# Altium schematic sheet Main.SchDoc
size A; SheetNumber: 1; SheetTotal: 3
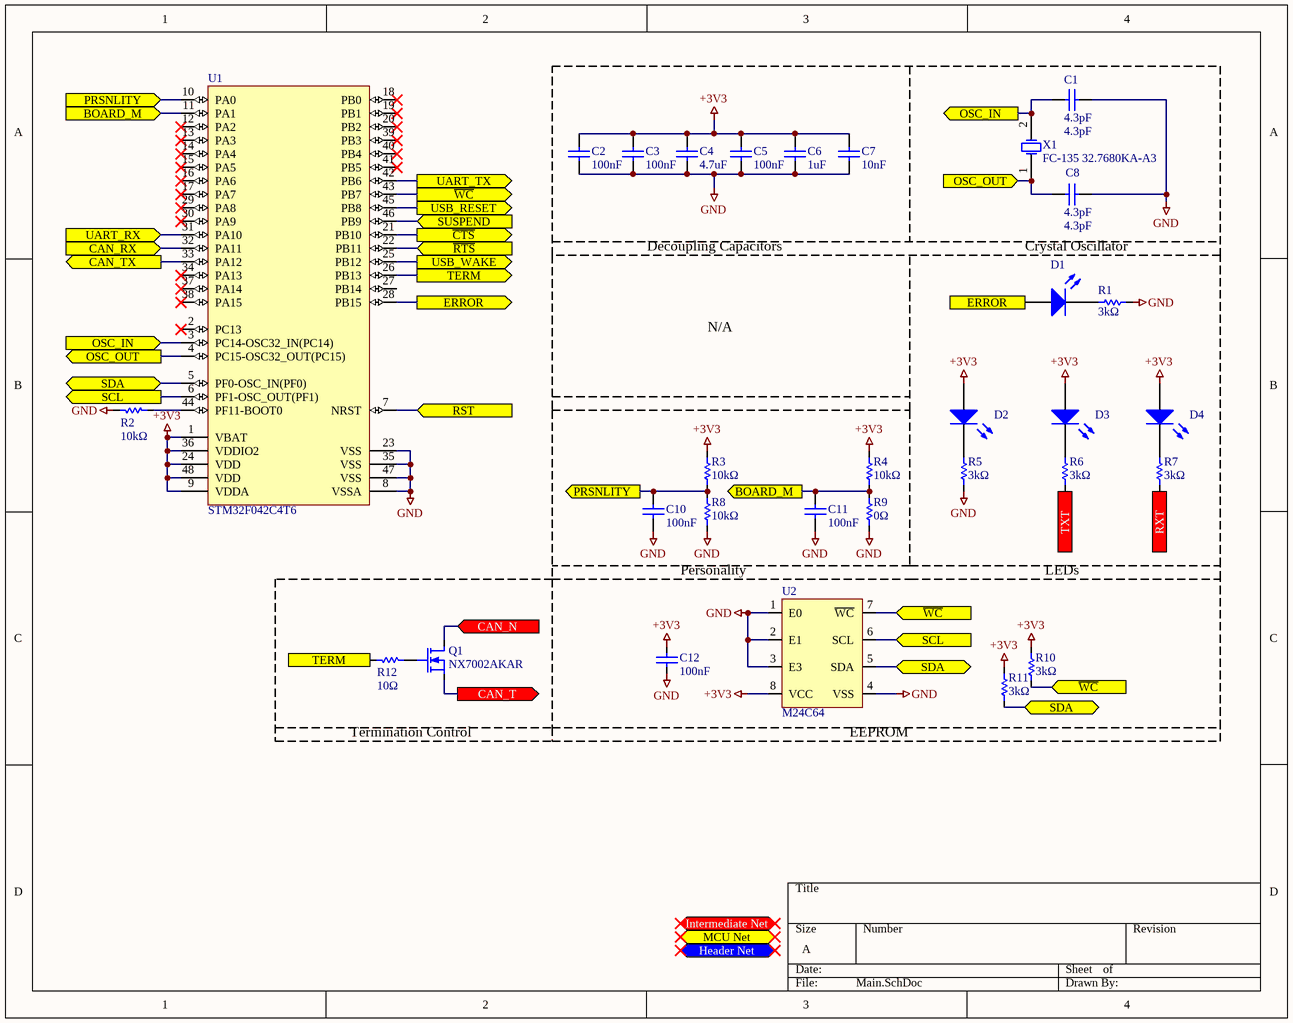
[diagram p0: Main.SchDoc]

## Parts
C1  4.3pF  [1608[0603]]
C2  100nF  [1608[0603]]
C3  100nF  [1608[0603]]
C4  4.7uF  [1608[0603]]
C5  100nF  [1608[0603]]
C6  1uF  [1608[0603]]
C7  10nF  [1608[0603]]
C8  4.3pF  [1608[0603]]
C10  100nF  [1608[0603]]
C11  100nF  [1608[0603]]
C12  100nF  [1608[0603]]
D1  POWER_ON  [1608[0603]]  (value not drawn)
D2  POWER_ON  [1608[0603]]  (value not drawn)
D3  POWER_ON  [1608[0603]]  (value not drawn)
D4  POWER_ON  [1608[0603]]  (value not drawn)
Q1  NX7002AKAR  [SOT23-6_L]
R1  value 3kΩ  [1608[0603]]  (hidden comment: 4.7k)
R2  value 10kΩ  [1608[0603]]  (hidden comment: 10k)
R3  value 10kΩ  [1608[0603]]  (hidden comment: 10k)
R4  value 10kΩ  [1608[0603]]  (hidden comment: 10k)
R5  value 3kΩ  [1608[0603]]  (hidden comment: 4.7k)
R6  value 3kΩ  [1608[0603]]  (hidden comment: 4.7k)
R7  value 3kΩ  [1608[0603]]  (hidden comment: 4.7k)
R8  value 10kΩ  [1608[0603]]  (hidden comment: 10k)
R9  value 0Ω  [1608[0603]]  (hidden comment: 0 ohm)
R10  value 3kΩ  [1608[0603]]  (hidden comment: 3k)
R11  value 3kΩ  [1608[0603]]  (hidden comment: 3k)
R12  value 10Ω  [1608[0603]]  (hidden comment: 10k)
U1  STM32F042C4T6  [STM-LQFP48_M]
U2  M24C64  [SO8_M]
X1  FC-135 32.7680KA-A3  [ESPO-FC-135-2_V]

## Ports
BOARD_M (in), BOARD_M (out), CAN_N (in), CAN_RX (in), CAN_T (out), CAN_TX (out), ERROR (in), ERROR (out), Header Net (bidir), Intermediate Net (bidir), MCU Net (bidir), OSC_IN (in), OSC_IN (out), OSC_OUT (in), OSC_OUT (out), PRSNLITY (in), PRSNLITY (out), RST (in), RXT (out), SCL (in), SCL (out), SDA (bidir), SUSPEND (in), TERM (in), TERM (out), TXT (out), UART_RX (in), UART_TX (out), USB_RESET (out), USB_WAKE (out), ~{CTS} (out), ~{RTS} (in), ~{WC} (in), ~{WC} (out)

## Nets
+3V3: C2.1 C3.1 C4.1 C5.1 C6.1 C7.1 C12.1 D2.1(A) D3.1(A) D4.1(A) R3.2 R4.2 R10.1 R11.1 U1.1(VBAT) U1.9(VDDA) U1.24(VDD) U1.36(VDDIO2) U1.48(VDD) U2.8(VCC)
GND: C1.2 C2.2 C3.2 C4.2 C5.2 C6.2 C7.2 C8.2 C10.2 C11.2 C12.2 R1.2 R2.2 R5.2 R8.1 R9.1 U1.8(VSSA) U1.23(VSS) U1.35(VSS) U1.47(VSS) U2.1(E0) U2.2(E1) U2.3(E3) U2.4(VSS)
~{CTS}: U1.21(PB10) ; port ~{CTS}
~{RTS}: U1.22(PB11) ; port ~{RTS}
BOARD_M: C11.1 R4.1 R9.2 U1.11(PA1) ; port BOARD_M
CAN_N: Q1.1(D) ; port CAN_N
CAN_RX: U1.32(PA11) ; port CAN_RX
CAN_T: Q1.3(S) ; port CAN_T
CAN_TX: U1.33(PA12) ; port CAN_TX
ERROR: D1.1(A) U1.28(PB15) ; port ERROR
OSC_IN: C1.1 U1.3(PC14-OSC32_IN(PC14)) X1.2(X2) ; port OSC_IN
OSC_OUT: C8.1 U1.4(PC15-OSC32_OUT(PC15)) X1.1(X1) ; port OSC_OUT
PRSNLITY: C10.1 R3.1 R8.2 U1.10(PA0) ; port PRSNLITY
RST: U1.7(NRST) ; port RST
RXT: R7.2 ; port RXT
SCL: U1.6(PF1-OSC_OUT(PF1)) U2.6(SCL) ; port SCL
SDA: R11.2 U1.5(PF0-OSC_IN(PF0)) U2.5(SDA) ; port SDA
SUSPEND: U1.46(PB9) ; port SUSPEND
TERM: R12.2 U1.26(PB13) ; port TERM
TXT: R6.2 ; port TXT
UART_RX: U1.31(PA10) ; port UART_RX
UART_TX: U1.42(PB6) ; port UART_TX
USB_RESET: U1.45(PB8) ; port USB_RESET
USB_WAKE: U1.25(PB12) ; port USB_WAKE
~{WC}: R10.2 U1.43(PB7) U2.7(~{WC}) ; port ~{WC}
NetD1_2: D1.2(K) R1.1
NetD2_2: D2.2(K) R5.1
NetD3_2: D3.2(K) R6.1
NetD4_2: D4.2(K) R7.1
NetQ1_2: Q1.2(G) R12.1
NetR2_1: R2.1 U1.44(PF11-BOOT0)

Not connected (* = marked no-connect by the designer): U1 2(PC13)* 12(PA2)* 13(PA3)* 14(PA4)* 15(PA5)* 16(PA6)* 17(PA7)* 18(PB0)* 19(PB1)* 20(PB2)* 27(PB14) 29(PA8)* 30(PA9)* 34(PA13)* 37(PA14)* 38(PA15)* 39(PB3)* 40(PB4)* 41(PB5)*

## Notes on the sheet
- Decoupling Capacitors
- Crystal Oscillator
- N/A
- Personality
- LEDs
- Termination Control
- (near U2) EEPROM

## Library data of the parts
C1-C8 C10-C12 = Cap Semi: Capacitor (Semiconductor SIM Model); Published: 8-Jun-2000; LatestRevisionDate: 29-May-2009; LatestRevisionNote: IPC-7351 Footprint Added.; PackageReference: C1206; Publisher: Altium Limited; PackageDescription: Chip Capacitor
  C1 C8: Value: 4.3pF
  C2 C3 C5 C10-C12: Value: 100nF
  C4: Value: 4.7uF
  C6: Value: 1uF
  C7: Value: 10nF
D1-D4 = LED2: Typical RED, GREEN, YELLOW, AMBER GaAs LED; Published: 8-Jun-2000; LatestRevisionDate: 17-Jul-2002; LatestRevisionNote: Re-released for DXP Platform.; PackageVersion: Feb-2002; PackageReference: 3.2X1.6X1.1; Publisher: Altium Limited; PackageDescription: SM LED; 2 Flat Leads
Q1 = MOSFET-N: N-Channel MOSFET; Published: 8-Jun-2000; LatestRevisionDate: 17-Jul-2002; LatestRevisionNote: Re-released for DXP Platform.; PackageVersion: 1995/1996; PackageReference: E3; Publisher: Altium Limited; PackageDescription: TO, Flat Index; 3 In-Line, Axial Leads; Body Dia. 4.6mm; Lead Dia. 0.5 mm (max)
R1-R12 = Res1: Resistor; Published: 8-Jun-2000; LatestRevisionDate: 17-Jul-2002; LatestRevisionNote: Re-released for DXP Platform.; PackageReference: AXIAL-0.3; Publisher: Altium Limited; PackageDescription: Axial Device, Thru-Hole; 2 Leads; 0.3 in Pin Spacing
U1 = CMP-0304-00102-2: ARM Cortex-M0 32-bit MCU, 16 KB Flash, 6 KB Internal RAM, 38 I/Os, 48-Pin LQFP, -40 to 85 degC, Tray; Manufacturer: STMicroelectronics; Operating Frequency(F) (Processor speed) (MHz): 48; FLASH Size (Prog) (kB): 16; Internal RAM Size (kB): 6; I/Os (High Current): 38; Supply Voltage(Vcc) min (V): 2; ComponentLink1Description: Manufacturer URL; Packing: Tray; ComponentLink2Description: Datasheet; ComponentLink2URL: http://www.st.com/st-web-ui/static/active/en/resource/technical/document/datasheet/DM00105814.pdf; DatasheetVersion: Rev. 5; ComponentLink1URL: http://www.st.com/; Package Reference: LQFP48; Mounting Technology: Surface Mount; Package Description: 48-Pin Low Profile Quad Flat Package, Body 7 x 7 mm, Pitch 0.5 mm; Core: ARM Cortex-M0; PartNumber: STM32F042C4T6
U2 = M24C64-RMN6P: EEPROM I2C 64k
X1 = CMP-2000-05107-1: Crystal, 32.768 KHz, 12.5 pF, -40 to 85 degC, 2-Pin SMD, RoHS, Tape and Reel; Manufacturer: Epson; Load Capacitance: 12.5pF; Frequency Stability: 20PPM; Drive Level: 0.5uW; Unit Weight: 0.000564oz; Brand: EpsonTiming; ESR: 65kOhms; Series: FC-135R/FC-135/FC-255; Height: 0.8mm; Operating Temperature Range: -40Cto+85C; Package / Case: 3.2mmx1.5mm; Factory Pack Quantity: 250; Product Category: Crystals; Frequency: 32.768kHz; Type: kHzCrystal; Package Description: 2-Pin Surface Mount Device, Body 3.2 x 1.5 mm; Width: 1.5mm; RoHS: True; Manufacturer URL: https://www.eea.epson.com/; Package Reference: FC-135; Datasheet Version: Nov-12; Tolerance: 20PPM; Mounting Style: SMD/SMT; Length: 3.2mm; Termination Style: SMD/SMT; Packaging: Reel; Datasheet URL: https://datasheet.ciiva.com/15116/getdatasheetpartid-112713-15116373.pdf